# EAGLE design displayBoard (EAGLE 7.4.0)
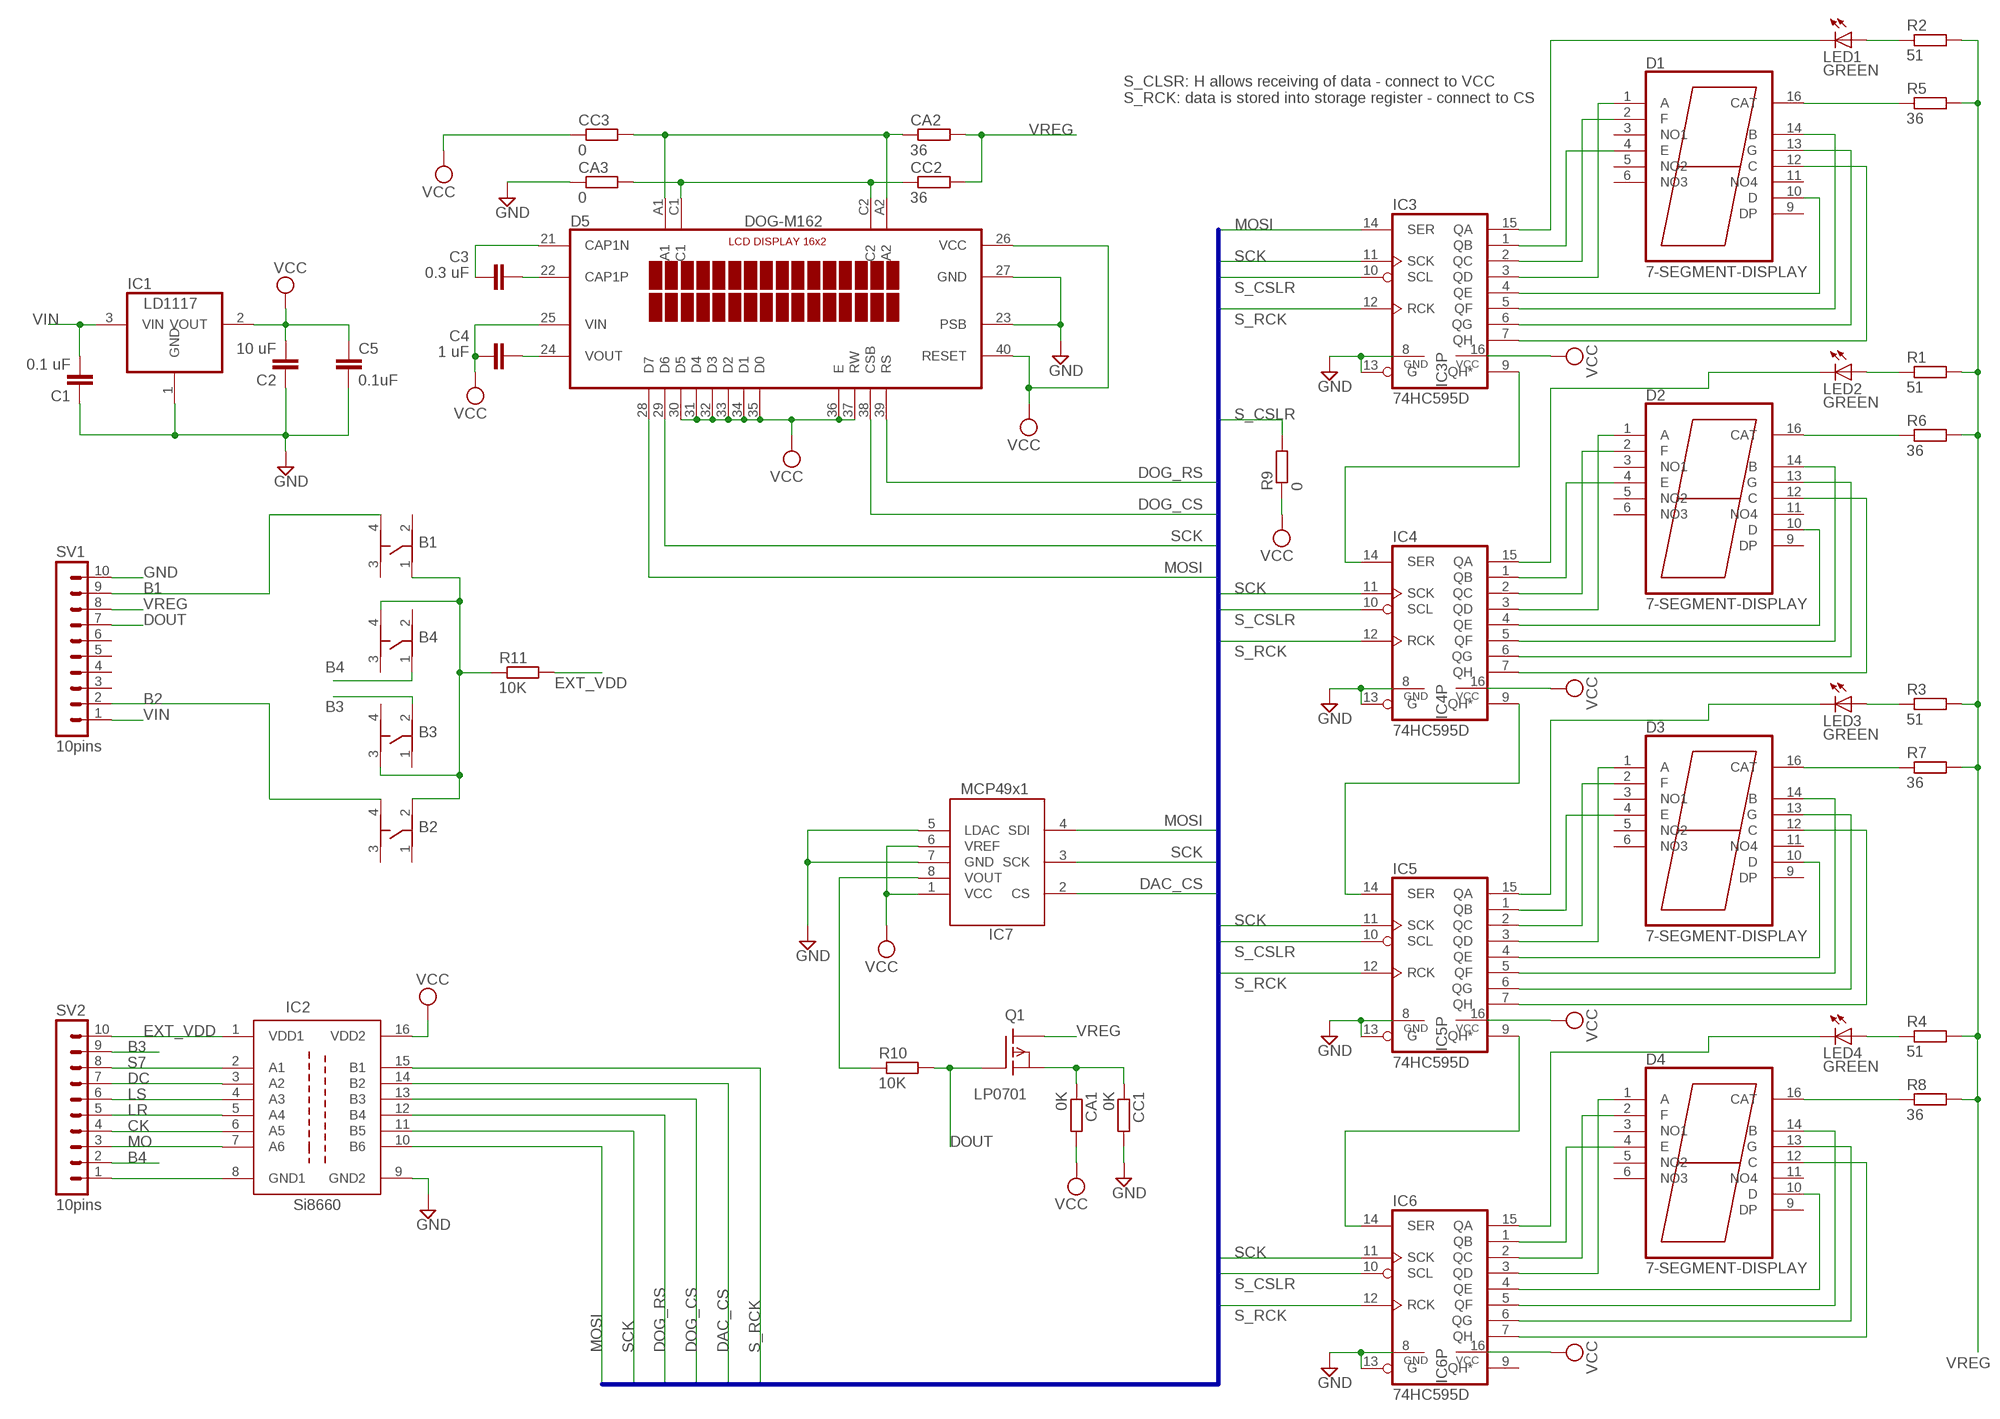
[diagram p0: schematic, sheet 1]

## Parts
B1  BUTTON-D6X  [BUTTON-D6X]
B2  BUTTON-D6X  [BUTTON-D6X]
B3  BUTTON-D6X  [BUTTON-D6X]
B4  BUTTON-D6X  [BUTTON-D6X]
C1  0.1 uF  C-EUC1206  [C1206]
C2  10 uF  C-EUC1206  [C1206]
C3  0.3 uF  C-EUC1206  [C1206]
C4  1 uF  C-EUC1206  [C1206]
C5  0.1uF  C-EUC1206  [C1206]
CA1  0K  R-EU_R1206  [R1206]
CA2  36  R-EU_R1206  [R1206]
CA3  0  R-EU_R1206  [R1206]
CC1  0K  R-EU_R1206  [R1206]
CC2  36  R-EU_R1206  [R1206]
CC3  0  R-EU_R1206  [R1206]
D1  7-SEGMENT-DISPLAY  [LDS-A812]
D2  7-SEGMENT-DISPLAY  [LDS-A812]
D3  7-SEGMENT-DISPLAY  [LDS-A812]
D4  7-SEGMENT-DISPLAY  [LDS-A812]
D5  DOG-M162  [DOGM162]
IC1  LD1117  REG1117  [SOT223]
IC2  SI-8660  [SOP-16]
IC3  74HC595D  [SO16]
IC4  74HC595D  [SO16]
IC5  74HC595D  [SO16]
IC6  74HC595D  [SO16]
IC7  MCP4921  MCP4901  [MSOP-8]
LED1  GREEN  LED3MM  [LED3MM]
LED2  GREEN  LED3MM  [LED3MM]
LED3  GREEN  LED3MM  [LED3MM]
LED4  GREEN  LED3MM  [LED3MM]
Q1  LP0701  LP0701N3  [TO-92]
R1  51  R-EU_R1206  [R1206]
R2  51  R-EU_R1206  [R1206]
R3  51  R-EU_R1206  [R1206]
R4  51  R-EU_R1206  [R1206]
R5  36  R-EU_R1206  [R1206]
R6  36  R-EU_R1206  [R1206]
R7  36  R-EU_R1206  [R1206]
R8  36  R-EU_R1206  [R1206]
R9  0  R-EU_R1206  [R1206]
R10  10K  R-EU_R1206  [R1206]
R11  10K  R-EU_R1206  [R1206]
SV1  10pins  MA10-1  [MA10-1]
SV2  10pins  MA10-1  [MA10-1]

## Nets
B1: B1.4 SV1.9
B2: B2.4 SV1.2
B3: B3.2 SV2.9
B4: B4.1 SV2.2
CK: IC2.6(A5) SV2.4
DAC_CS: IC2.14(B2) IC7.2(CS)
DC: IC2.3(A2) SV2.7
DOG_CS: D5.38(CSB) IC2.13(B3)
DOG_RS: D5.39(RS) IC2.12(B4)
DOUT: Q1.2(G) R10.2 SV1.7
EXT_VDD: IC2.1(VDD1) R11.2 SV2.10
GND: C1.1 C2.1 C5.2 CA3.1 CC1.2 D5.23(PSB) D5.27(GND) IC1.1(GND) IC2.9(GND2) IC3.8(GND) IC3.13(G) IC4.8(GND) IC4.13(G) IC5.8(GND) IC5.13(G) IC6.8(GND) IC6.13(G) IC7.5(LDAC) IC7.7(GND) SV1.10
LR: IC2.5(A4) SV2.5
LS: IC2.4(A3) SV2.6
MO: IC2.7(A6) SV2.3
MOSI: D5.28(D7) IC2.10(B6) IC3.14(SER) IC7.4(SDI)
N$4: D1.12(C) IC3.7(QH)
N$5: D2.4(E) IC4.1(QB)
N$6: D2.1(A) IC4.3(QD)
N$10: D2.10(D) IC4.4(QE)
N$11: D2.13(G) IC4.6(QG)
N$13: D3.4(E) IC5.1(QB)
N$17: D3.2(F) IC5.2(QC)
N$22: D3.1(A) IC5.3(QD)
N$24: D3.13(G) IC5.6(QG)
N$26: D3.12(C) IC5.7(QH)
N$27: D4.4(E) IC6.1(QB)
N$36: IC2.8(GND1) SV2.1
N$37: B1.1 B2.2 B3.3 B4.4 R11.1
N$46: LED4.A R4.1
N$47: LED3.A R3.1
N$48: IC6.15(QA) LED4.K(C)
N$52: IC7.8(VOUT) R10.1
N$63: IC5.15(QA) LED3.K(C)
N$65: IC4.15(QA) LED2.K(C)
N$66: D1.4(E) IC3.1(QB)
N$67: D1.2(F) IC3.2(QC)
N$68: LED2.A R1.1
N$69: D1.1(A) IC3.3(QD)
N$70: D1.10(D) IC3.4(QE)
N$71: D1.14(B) IC3.5(QF)
N$72: D1.13(G) IC3.6(QG)
N$75: D2.2(F) IC4.2(QC)
N$78: D2.14(B) IC4.5(QF)
N$80: D2.12(C) IC4.7(QH)
N$81: IC3.9(QH*) IC4.14(SER)
N$85: D3.10(D) IC5.4(QE)
N$86: D3.14(B) IC5.5(QF)
N$90: D4.2(F) IC6.2(QC)
N$91: D4.1(A) IC6.3(QD)
N$92: D4.10(D) IC6.4(QE)
N$93: D4.14(B) IC6.5(QF)
N$94: D4.13(G) IC6.6(QG)
N$95: D4.12(C) IC6.7(QH)
N$96: IC5.9(QH*) IC6.14(SER)
N$97: IC4.9(QH*) IC5.14(SER)
N$98: D1.16(CAT) R5.1
N$99: D2.16(CAT) R6.1
N$100: D3.16(CAT) R7.1
N$101: D4.16(CAT) R8.1
N$103: IC3.15(QA) LED1.K(C)
N$104: LED1.A R2.1
N$137: CA1.1 CC1.1 Q1.1(S)
N$139: CA2.1 CC3.2 D5.A1 D5.A2
N$141: C3.1 D5.21(CAP1N)
N$142: C3.2 D5.22(CAP1P)
N$143: C4.1 D5.24(VOUT)
N$144: CA3.2 CC2.1 D5.C1 D5.C2
S7: IC2.2(A1) SV2.8
S_CSLR: IC3.10(SCL) IC4.10(SCL) IC5.10(SCL) IC6.10(SCL) R9.2
S_RCK: IC2.15(B1) IC3.12(RCK) IC4.12(RCK) IC5.12(RCK) IC6.12(RCK)
SCK: D5.29(D6) IC2.11(B5) IC3.11(SCK) IC4.11(SCK) IC5.11(SCK) IC6.11(SCK) IC7.3(SCK)
VCC: C2.2 C4.2 C5.1 CA1.2 CC3.1 D5.25(VIN) D5.26(VCC) D5.30(D5) D5.31(D4) D5.32(D3) D5.33(D2) D5.34(D1) D5.35(D0) D5.36(E) D5.37(RW) D5.40(RESET) IC1.2(VOUT) IC2.16(VDD2) IC3.16(VCC) IC4.16(VCC) IC5.16(VCC) IC6.16(VCC) IC7.1(VCC) IC7.6(VREF) R9.1
VIN: C1.2 IC1.3(VIN) SV1.1
VREG: CA2.2 CC2.2 Q1.3(D) R1.2 R2.2 R3.2 R4.2 R5.2 R6.2 R7.2 R8.2 SV1.8
Unconnected: B1.2 B1.3 B2.1 B2.3 B3.1 B3.4 B4.2 B4.3 D1.3(NO1) D1.5(NO2) D1.6(NO3) D1.9(DP) D1.11(NO4) D2.3(NO1) D2.5(NO2) D2.6(NO3) D2.9(DP) D2.11(NO4) D3.3(NO1) D3.5(NO2) D3.6(NO3) D3.9(DP) D3.11(NO4) D4.3(NO1) D4.5(NO2) D4.6(NO3) D4.9(DP) D4.11(NO4) IC6.9(QH*) SV1.3 SV1.4 SV1.5 SV1.6

## Buses
MOSI,SCK,S_CSLR,S_RCK,DOG_RS,DOG_CS,DAC_CS

## Notes on the sheet
- S_CLSR: H allows receiving of data - connect to VCC
  S_RCK: data is stored into storage register - connect to CS

## Library data of the parts
B1-B4 = MyComponents:BUTTON-D6X
C1-C5 = rcl:C-EU: CAPACITOR, European symbol
CA1-CA3 CC1-CC3 R1-R11 = rcl:R-EU_: RESISTOR, European symbol
D1-D4 = MyComponents:7-SEGMENT-DISPLAY: 20.32mm (0.8INCH) SINGLE DIGIT NUMERIC DISPLAY
D5 = MyComponents:DOG-M162: LCD display DOG-SERIE 3,3V. Controlleer ST7036 for 4-/8-BIT, SPI.
IC1 = burr-brown:REG1117: 800mA and 1A Low Dropout (LDO) Positive Regulator 1.8V, 2.5V, 2.85V, 3.3V, 5V, and Adj; MPN: REG1117; OC_FARNELL: 1097566; OC_NEWARK: 14P6981
IC2 = MyComponents:SI-8660: Ultra-low-power digital isolator (6 channels)
IC3-IC6 = 74xx-eu:74*595: 8-bit SHIFT REGISTER, output latch
IC7 = MyComponents:MCP4901: 8/10/12-Bit Voltage Output Digital-to-Analog Converter with SPI Interface
LED1-LED4 = led:LED: LED OSRAM: - CHIPLED LG R971, LG N971, LY N971, LG Q971, LY Q971, LO R971, LY R971 LH N974, LH R974 LS Q976, LO Q976, LY Q976 LO Q996 - Hyper CHIPLED LW Q18S LB Q993, LB Q99A, LB R99A - SideLED LS A670, LO A670, LY A670, LG A670, LP A670 LB A673, LV A673, LT A673, LW A673 LH A674 LY A675 LS A676, LA A676, LO A676, LY A676, LW A676 LS A679, LY A679, LG A679 - Hyper Micro SIDELED® LS Y876, LA Y876, LO Y876, LY Y876 LT Y87S - SmartLED LW L88C, LW L88S LB L89C, LB L89S, LG L890 LS L89K, LO L89K, LY L89K LS L896, LA L896, LO L896, LY L896 - TOPLED LS T670, LO T670, LY T670, LG T670, LP T670 LSG T670, LSP T670, LSY T670, LOP T670, LYG T670 LG T671, LOG T671, LSG T671 LB T673, LV T673, LT T673, LW T673 LH T674 LS T676, LA T676, LO T676, LY T676, LB T676, LH T676, LSB T676, LW T676 LB T67C, LV T67C, LT T67C, LS T67K, LO T67K, LY T67K, LW E67C LS E67B, LA E67B, LO E67B, LY E67B, LB E67C, LV E67C, LT E67C LW T67C LS T679, LY T679, LG T679 LS T770, LO T770, LY T770, LG T770, LP T770 LB T773, LV T773, LT T773, LW T773 LH T774 LS E675, LA E675, LY E675, LS T675 LS T776, LA T776, LO T776, LY T776, LB T776 LHGB T686 LT T68C, LB T68C - Hyper Mini TOPLED® LB M676 - Mini TOPLED Santana® LG M470 LS M47K, LO M47K, LY M47K Source: http://www.osram.convergy.de LUXEON: - LUMILED® LXK2-PW12-R00, LXK2-PW12-S00, LXK2-PW14-U00, LXK2-PW14-V00 LXK2-PM12-R00, LXK2-PM12-S00, LXK2-PM14-U00 LXK2-PE12-Q00, LXK2-PE12-R00, LXK2-PE12-S00, LXK2-PE14-T00, LXK2-PE14-U00 LXK2-PB12-K00, LXK2-PB12-L00, LXK2-PB12-M00, LXK2-PB14-N00, LXK2-PB14-P00, LXK2-PB14-Q00 LXK2-PR12-L00, LXK2-PR12-M00, LXK2-PR14-Q00, LXK2-PR14-R00 LXK2-PD12-Q00, LXK2-PD12-R00, LXK2-PD12-S00 LXK2-PH12-R00, LXK2-PH12-S00 LXK2-PL12-P00, LXK2-PL12-Q00, LXK2-PL12-R00 Source: www.luxeon.com KINGBRIGHT: KA-3528ASYC Source: www.kingbright.com
Q1 = transistor-fet:LP0701N3: P-Channel Enhancement MOSFET -16,5V; -1,25A; 1,5Ohm
SV1 SV2 = con-lstb:MA10-1: PIN HEADER; OC_FARNELL: unknown; OC_NEWARK: unknown

## Board
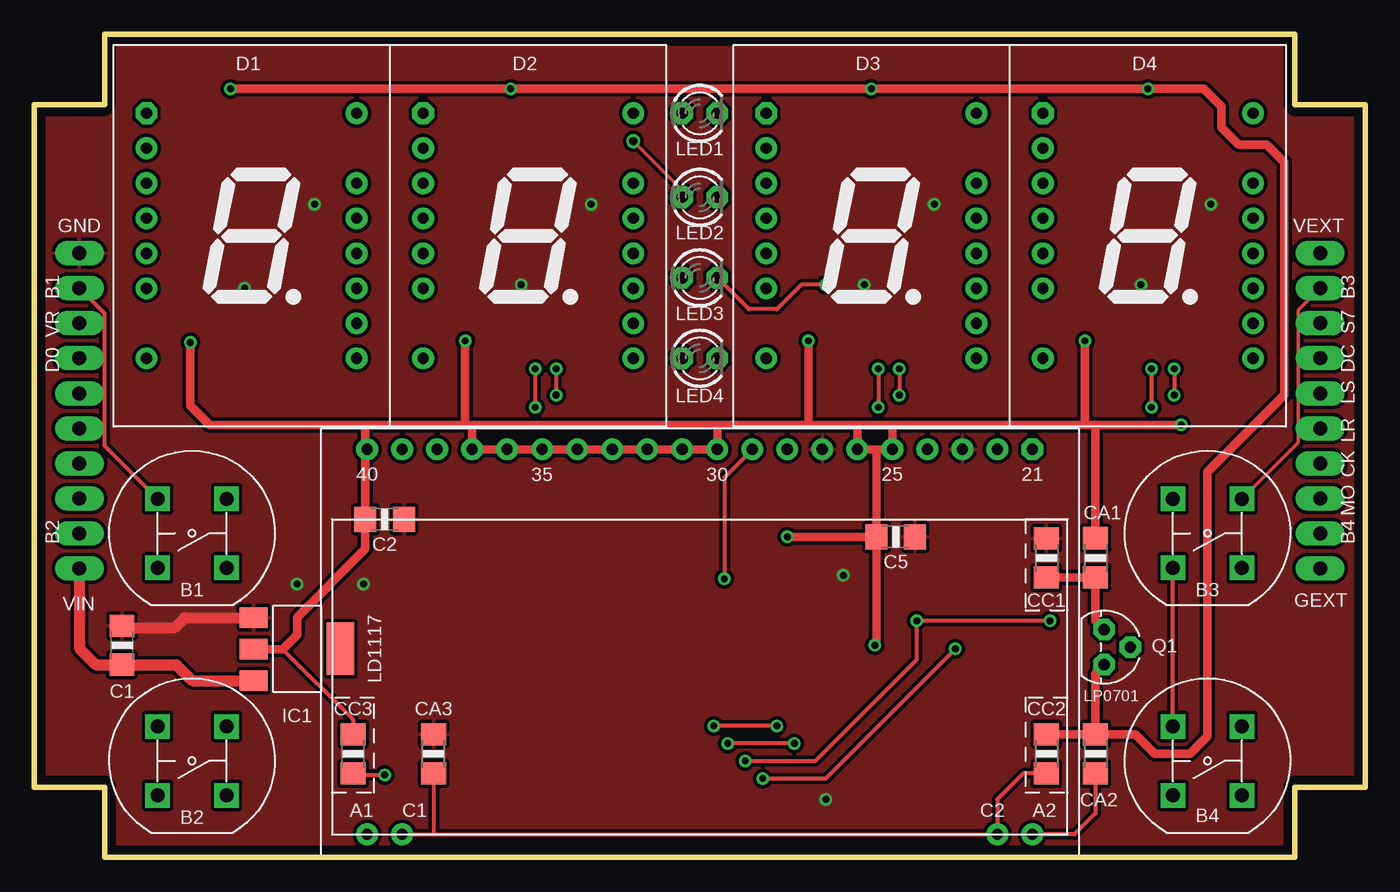
[diagram p1: board, top side]
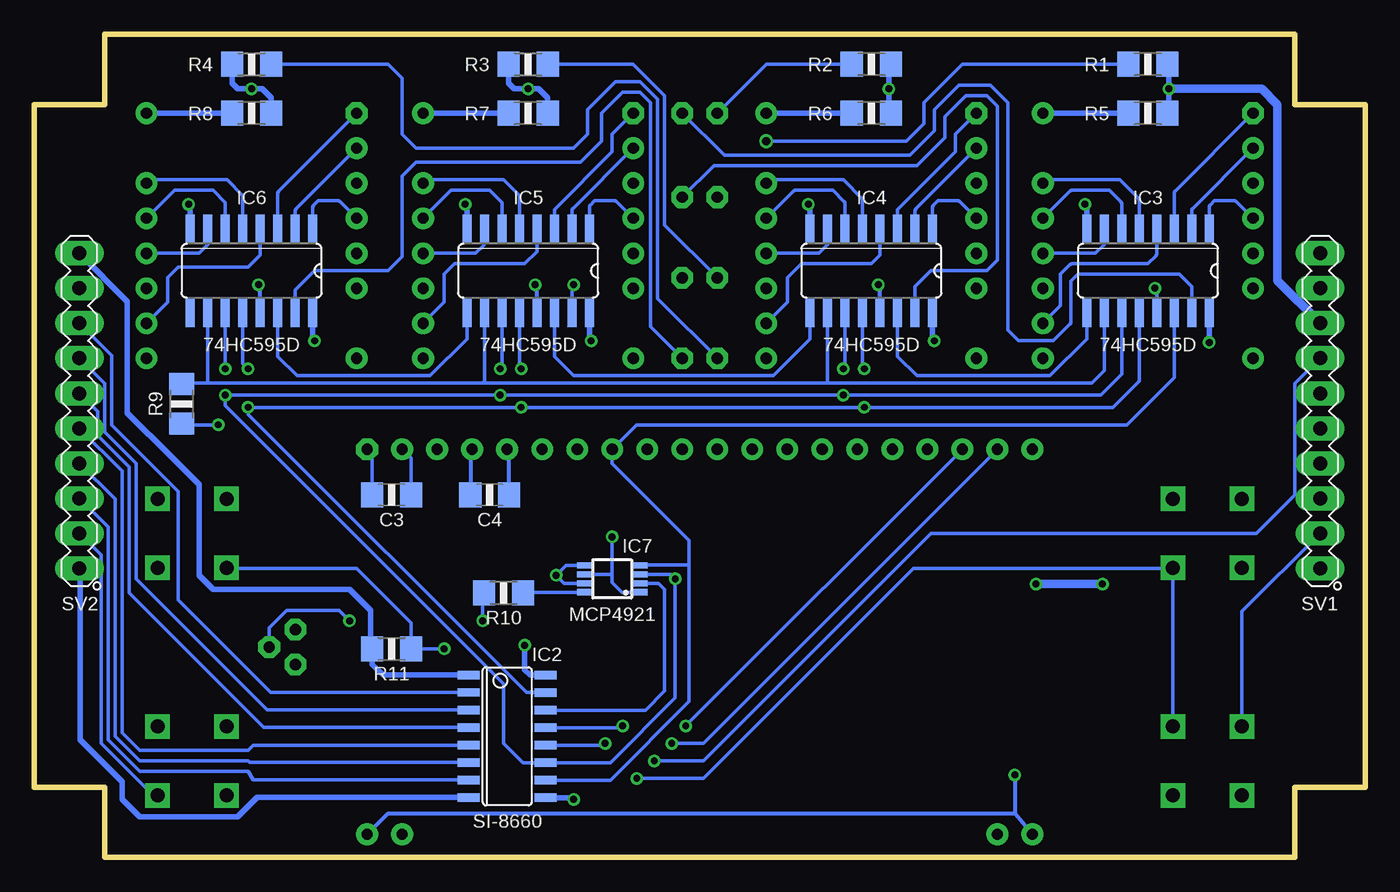
[diagram p2: board, bottom side, seen from below]

Size 96.52 x 59.69 mm. Coordinates in mm from the lower left corner, seen from the top.
Outline: 0,5.08 0,54.61 5.08,54.61 5.08,59.69 91.44,59.69 91.44,54.61 96.52,54.61 96.52,5.08 91.44,5.08 91.44,0 5.08,0 5.08,5.08 0,5.08
Copper layers (1*16): Top 0.035mm / dielectric 1.5mm / Bottom 0.035mm
Design rules "default *": minimum track width 0.000253125mm, minimum drill 0.00048125mm, track to track 10mil, track to pad 12mil, pad to pad 12mil, via to via 12mil, smd to smd 4mil, copper to edge 25mil, drill to drill 40mil, minimum pad ring 15mil, minimum via ring 8mil, stop-mask expansion 4mil, vias tented up to drill 0mil, thermal gap 10mil

### Footprints (pad centres in the part's own frame; a part is rotated, then mirrored left to right if it is on the bottom)
BUTTON-D6X = drill 1.016 square: 1 2.5,-2.5; 2 2.5,2.5; 3 -2.5,-2.5; 4 -2.5,2.5
C1206 = smd 1.6 x 1.8: 1 -1.4,0; 2 1.4,0
R1206 = smd 1.6 x 1.803: 1 -1.422,0; 2 1.422,0
LDS-A812 = drill 0.813 octagon: 1 -7.62,8.89 | drill 0.813: 2 -7.62,6.35; 3 -7.62,3.81; 4 -7.62,1.27; 5 -7.62,-1.27; 6 -7.62,-3.81; 9 7.62,-8.89; 10 7.62,-6.35; 11 7.62,-3.81; 12 7.62,-1.27; 13 7.62,1.27; 14 7.62,3.81; 16 7.62,8.89; P$1 -7.62,-8.89
DOGM162 = drill 0.813 octagon: 21 24.13,13.97 | drill 0.813: 22 21.59,13.97; 23 19.05,13.97; 24 16.51,13.97; 25 13.97,13.97; 26 11.43,13.97; 27 8.89,13.97; 28 6.35,13.97; 29 3.81,13.97; 30 1.27,13.97; 31 -1.27,13.97; 32 -3.81,13.97; 33 -6.35,13.97; 34 -8.89,13.97; 35 -11.43,13.97; 36 -13.97,13.97; 37 -16.51,13.97; 38 -19.05,13.97; 39 -21.59,13.97; 40 -24.13,13.97; A1 -24.13,-13.97; A2 24.13,-13.97; C1 -21.59,-13.97; C2 21.59,-13.97
SOT223 = smd 1.499 x 2.007: 1 -2.261,-3.15; 2 0.025,-3.15; 3 2.311,-3.15 | smd 3.81 x 2.007: 4 0,3.15
SOP-16 = smd 0.6 x 1.6: 1 -4.445,-2.8; 2 -3.185,-2.8; 3 -1.915,-2.8; 4 -0.645,-2.8; 5 0.635,-2.8; 6 1.895,-2.8; 7 3.165,-2.8; 8 4.435,-2.8; 9 4.445,2.8; 10 3.175,2.8; 11 1.905,2.8; 12 0.635,2.8; 13 -0.635,2.8; 14 -1.905,2.8; 15 -3.175,2.8; 16 -4.445,2.8
SO16 = smd 0.66 x 2.032: 1 -4.445,-3.073; 2 -3.175,-3.073; 3 -1.905,-3.073; 4 -0.635,-3.073; 5 0.635,-3.073; 6 1.905,-3.073; 7 3.175,-3.073; 8 4.445,-3.073; 9 4.445,3.073; 10 3.175,3.073; 11 1.905,3.073; 12 0.635,3.073; 13 -0.635,3.073; 14 -1.905,3.073; 15 -3.175,3.073; 16 -4.445,3.073
MSOP-8 = smd 0.45 x 1: 1 -0.975,-2.05; 2 -0.325,-2.05; 3 0.325,-2.05; 4 0.975,-2.05; 5 0.975,2.05; 6 0.325,2.05; 7 -0.325,2.05; 8 -0.975,2.05
LED3MM = drill 0.813 octagon: A -1.27,0; K 1.27,0
TO-92 = drill 0.813 octagon: 1 -1.27,0; 2 0,1.905; 3 1.27,0
MA10-1 = drill 1.016 long: 1 -11.43,0; 2 -8.89,0; 3 -6.35,0; 4 -3.81,0; 5 -1.27,0; 6 1.27,0; 7 3.81,0; 8 6.35,0; 9 8.89,0; 10 11.43,0

### Placement (x,y rotation side)
B1  11.43,23.49 0 top
B2  11.43,6.99 0 top
B3  85.09,23.49 0 top
B4  85.09,6.99 0 top
C1  6.35,15.37 270 top
C2  25.4,24.51 180 top
C3  70.61,26.29 0 bottom
C4  63.5,26.29 0 bottom
C5  62.48,23.24 0 top
CA1  76.97,21.72 90 top
CA2  76.96,7.49 90 top
CA3  28.96,7.49 270 top
CC1  73.41,21.71 90 top
CC2  73.41,7.49 90 top
CC3  23.11,7.49 270 top
D1  15.75,45.09 0 top
D2  35.81,45.09 0 top
D3  60.71,45.09 0 top
D4  80.77,45.09 0 top
D5  48.26,15.62 0 top
IC1  19.05,15.11 270 top
IC2  62.23,8.76 270 bottom
IC3  15.75,42.55 180 bottom
IC4  35.81,42.55 180 bottom
IC5  60.71,42.55 180 bottom
IC6  80.77,42.55 180 bottom
IC7  54.61,20.19 90 bottom
LED1  48.26,53.98 0 top
LED2  48.26,47.88 0 top
LED3  48.26,42.04 0 top
LED4  48.26,36.2 0 top
Q1  77.6,15.24 270 top
R1  15.75,57.53 0 bottom
R2  35.81,57.53 0 bottom
R3  60.71,57.53 180 bottom
R4  80.77,57.53 180 bottom
R5  15.75,53.98 0 bottom
R6  35.81,53.98 0 bottom
R7  60.71,53.98 0 bottom
R8  80.77,53.98 0 bottom
R9  85.85,32.89 90 bottom
R10  62.48,19.18 180 bottom
R11  70.61,15.11 180 bottom
SV1  3.26,32.39 90 bottom
SV2  93.26,32.39 90 bottom

### Tracks (layer width: path | path; a pad name or v marks a point on that pad's centre or on a via)
B1
  Top 0.305: B1.4 5.08,29.84 5.08,39.46 SV1.9
B2
  Bottom 0.254: SV1.2 8.93,17.82 B2.4
B3
  Top 0.254: B3.2 91.69,30.1 91.69,39.71 SV2.9
B4
  Bottom 0.254: B4.1 87.92,4.49 91.69,8.26 91.69,21.93 SV2.2
CK
  Bottom 0.254: IC2.6 80.91,6.87 81.03,6.99 88.9,6.99 90.68,8.76 90.68,25.99 SV2.4
DAC_CS
  Bottom 0.254: IC7.2 51.24,19.87 50.8,19.43 50.8,12.06 52.2,10.67 IC2.14
DC
  Bottom 0.254: IC2.3 79.64,10.68 89.15,20.19 89.15,28.57 91.44,30.86 91.44,34.38 SV2.7
DOG_CS  (via drill 0.5 pad 0.25)
  Top 0.305: v53.85,9.53 v49.28,9.53
  Bottom 0.254: 59.3,9.27 IC2.13 53.98,9.4 v53.85,9.53 | v49.28,9.53 D5.38
DOG_RS  (via drill 0.5 pad 0.25)
  Top 0.305: v55.12,8.26 v50.29,8.26
  Bottom 0.254: 59.3,8 IC2.12 55.24,8.13 v55.12,8.26 | D5.39 48.01,8.26 v50.29,8.26
DOUT  (via drill 0.5, 0.5 pad 0.25)
  Top 0.305: v51.56,6.99 56.64,6.99 64.01,14.35 v64.01,17.14 v73.66,17.14
  Bottom 0.254: SV1.7 5.08,34.38 5.08,26.29 7.87,23.49 31.5,23.49 48.01,6.99 v51.56,6.99 | R10.2 64.01,19.07 v64.01,17.14 | Q1.2 79.5,16.64 78.23,17.91 74.42,17.91 v73.66,17.14
EXT_VDD
  Bottom 0.406: SV2.10 89.78,40.31 89.78,32.23 86.61,29.08 84.58,27.05 84.58,20.45 83.57,19.43 73.66,19.43 72.14,17.91 72.14,15.21 R11.2 72.03,14 71.25,13.21 IC2.1
GND  (via drill 0.5, 0.5 pad 0.25)
  Top 0.813: C1.1 6.48,16.64 10.16,16.64 10.9,17.37 IC1.1
  Bottom 0.254: IC3.13 15.11,41.15 v15.24,41.27 | 40.26,47.14 arc-45 40.33,47.32 | 85.22,47.14 arc-45 85.29,47.32 | IC7.5 57.95,21.17 v58.67,20.45 58.09,19.87 IC7.7
  Bottom 0.305: IC4.13 35.18,41.15 v35.31,41.53 | IC5.13 60.07,41.4 v60.2,41.53 | IC6.13 80.14,41.4 v80.26,41.53
  Bottom 0.406: IC3.8 20.19,47.14 arc-45 20.27,47.32 v20.32,47.37 | IC4.8 40.26,47.14 | 40.33,47.32 v40.39,47.37 | IC5.8 65.15,47.14 arc-45 65.22,47.32 v65.28,47.37 | IC6.8 85.22,47.14 | 85.29,47.32 v85.34,47.37 | IC2.9 57.53,4.32 v57.4,4.19
  Bottom 0.61: v19.05,19.81 v23.87,19.82
  pour Top: 0,54.61 5.08,54.61 5.08,59.69 91.44,59.69 91.44,54.61 96.52,54.61 96.52,5.08 91.44,5.08 91.44,0 5.08,0 5.08,5.08 0,5.08
LR
  Bottom 0.254: IC2.5 80.64,8.13 81.03,7.75 88.9,7.75 90.17,9.02 90.17,28.02 SV2.5
LS
  Bottom 0.254: SV2.6 91.95,32.34 91.95,30.61 89.66,28.32 89.66,19.18 79.89,9.41 IC2.4
MO
  Bottom 0.254: IC2.7 80.66,5.6 81.03,6.22 88.9,6.22 91.19,8.51 91.19,23.96 SV2.3
MOSI
  Bottom 0.254: IC3.14 13.84,34.8 17.27,31.37 52.83,31.37 D5.28 54.61,28.57 49.02,22.99 49.02,21.21 | 49.02,21.21 49.02,11.3 54.74,5.59 IC2.10 | IC7.4 52.52,21.21 49.02,21.21
N$4
  Bottom 0.254: IC3.7 18.92,44.45 19.56,43.82 D1.12
N$5
  Bottom 0.254: IC4.1 31.37,47.14 arc45 31.3,47.32 30.99,47.62 29.57,47.62 arc45 29.39,47.55 D2.4
N$6
  Bottom 0.254: D2.1 29.72,52.45 29.72,51.18 33.91,46.99 IC4.3
N$10
  Bottom 0.254: IC4.4 35.18,43.69 35.81,43.05 40.89,43.05 41.91,42.04 41.91,40.26 D2.10
N$11
  Bottom 0.254: IC4.6 37.72,47.39 arc-45 37.79,47.57 38.61,48.39 41.3,48.39 arc-45 41.48,48.31 D2.13
N$13
  Bottom 0.254: IC5.1 56.26,47.14 arc45 56.19,47.32 55.88,47.62 54.46,47.62 arc45 54.28,47.55 D3.4
N$17
  Bottom 0.254: IC5.2 57.53,46.89 arc45 57.46,47.06 D3.2
N$22
  Bottom 0.254: D3.1 54.61,52.45 54.61,51.18 58.8,46.99 IC5.3
N$24
  Bottom 0.254: IC5.6 62.61,47.5 63.5,48.39 66.29,48.39 D3.13
N$26
  Bottom 0.254: IC5.7 63.88,44.55 arc45 63.95,44.38 64.52,43.82 D3.12
N$27
  Bottom 0.254: IC6.1 76.33,47.14 arc45 76.25,47.32 75.95,47.62 74.53,47.62 arc45 74.35,47.55 D4.4
N$36
  Bottom 0.254: 93.22,20.91 SV2.1
  Bottom 0.406: 93.22,20.91 93.22,8.51 90.17,5.46 90.17,4.19 88.9,2.92 81.79,2.92 80.38,4.33 IC2.8
N$37  (via drill 0.5 pad 0.25)
  Top 0.305: v52.83,5.71 57.4,5.71 v66.8,15.11 | B4.4 B3.3
  Bottom 0.254: v66.8,15.11 R11.1 69.19,16.99 73.15,20.95 82.55,20.95 B3.3 | B2.2 B1.1 13.97,20.95 32.77,20.95 48.01,5.71 v52.83,5.71
N$44  (via drill 0.5 pad 0.25)
  other vias: 53.85,9.53
N$46
  Bottom 0.254: R4.1 70.87,57.53 69.85,56.52 69.85,52.45 68.83,51.44 57.4,51.44 56.39,52.45 56.39,54.23 54.36,56.26 52.58,56.26 51.31,54.99 51.31,40.51 51.05,40.26 LED4.A
N$47
  Bottom 0.254: R3.1 53.09,57.53 50.8,55.25 50.8,45.85 LED3.A
N$48
  Bottom 0.254: 77.6,39.62 IC6.15 77.6,41.15 76.2,42.55 70.87,42.55 69.85,43.56 69.85,49.4 68.83,50.42 56.9,50.42 55.37,51.94 55.37,53.98 53.85,55.5 52.58,55.5 51.82,54.74 51.82,38.48 LED4.K
N$52
  Bottom 0.254: R10.1 61.78,19.22 IC7.8
N$63  (via drill 0.5)
  Top 0.305: v57.4,41.53 55.63,41.53 53.85,39.75 51.82,39.75 LED3.K
  Bottom 0.254: IC5.15 57.53,41.4 v57.4,41.53
N$65
  Bottom 0.254: IC4.15 32.64,41.4 31.5,42.55 27.43,42.55 26.67,43.31 26.67,54.48 27.43,55.25 28.96,55.25 30.48,53.72 30.48,52.2 32.51,50.16 47.24,50.16 LED2.K
N$66
  Bottom 0.254: IC3.1 11.3,47.14 arc45 11.23,47.32 10.92,47.62 9.5,47.62 arc45 9.32,47.55 D1.4
N$67
  Bottom 0.254: IC3.2 12.57,46.89 arc45 12.5,47.06 D1.2
N$68  (via drill 0.6)
  Top 0.254: v43.43,51.94 46.99,48.39 LED2.A
  Bottom 0.254: R1.1 29.21,57.53 32,54.74 32,53.21 33.27,51.94 v43.43,51.94
N$69
  Bottom 0.254: IC3.3 13.84,48.16 arc45 13.77,48.33 D1.1
N$70
  Bottom 0.254: IC3.4 15.11,43.79 arc45 15.19,43.61 15.75,43.05 21.23,43.05 arc-45 21.41,42.98 22.1,42.29 22.1,40.11 arc45 22.17,39.93 D1.10
N$71
  Bottom 0.254: IC3.5 16.38,47.65 arc-45 16.46,47.83 17.78,49.15 23.01,49.15 arc-45 23.19,49.08 D1.14
N$72
  Bottom 0.254: IC3.6 17.65,47.39 arc-45 17.73,47.57 18.54,48.39 21.23,48.39 arc-45 21.41,48.31 D1.13
N$75
  Bottom 0.254: IC4.2 32.64,46.89 arc45 32.56,47.06 D2.2
N$78
  Bottom 0.254: IC4.5 36.45,47.75 37.85,49.15 43.08,49.15 arc-45 43.25,49.08 D2.14
N$80
  Bottom 0.254: IC4.7 38.99,44.45 39.62,43.82 D2.12
N$81
  Bottom 0.254: IC3.9 20.19,37.59 22.86,34.93 32.51,34.93 33.91,36.32 IC4.14
N$85
  Bottom 0.254: IC5.4 60.07,43.94 60.96,43.05 66.04,43.05 66.8,42.29 66.8,40.26 D3.10
N$86
  Bottom 0.254: IC5.5 61.34,48.01 62.48,49.15 68.07,49.15 D3.14
N$90
  Bottom 0.254: IC6.2 77.6,46.89 arc45 77.52,47.06 D4.2
N$91
  Bottom 0.254: IC6.3 78.87,48.16 arc45 78.79,48.33 D4.1
N$92
  Bottom 0.254: IC6.4 80.14,43.69 81.03,42.8 86.11,42.8 86.87,42.04 86.87,40.26 D4.10
N$93
  Bottom 0.254: IC6.5 81.41,48.01 82.55,49.15 88.14,49.15 D4.14
N$94
  Bottom 0.254: IC6.6 82.68,47.5 83.57,48.39 86.36,48.39 D4.13
N$95
  Bottom 0.254: IC6.7 83.95,44.45 84.58,43.82 D4.12
N$96
  Bottom 0.254: IC5.9 65.15,37.59 67.82,34.93 77.47,34.93 78.87,36.32 IC6.14
N$97
  Bottom 0.254: IC4.9 40.26,37.59 42.93,34.93 57.4,34.93 58.8,36.32 IC5.14
N$98
  Bottom 0.406: D1.16 R5.1
N$99
  Bottom 0.406: D2.16 R6.1
N$100
  Bottom 0.406: R7.1 D3.16
N$101
  Bottom 0.406: R8.1 D4.16
N$103
  Bottom 0.254: IC3.15 12.57,41.4 13.46,42.29 20.72,42.29 arc-45 20.9,42.22 21.34,41.78 21.34,38.84 arc45 21.41,38.66 22.61,37.47 25.15,37.47 25.91,38.23 25.91,54.74 27.18,56.01 29.46,56.01 31.24,54.23 31.24,52.71 33.02,50.93 46.48,50.93 LED1.K
N$104
  Bottom 0.254: 37.24,57.79 R2.1 43.43,57.53 LED1.A
N$105  (via drill 0.5 pad 0.25)
  other vias: 49.28,9.53
N$106  (via drill 0.5 pad 0.25)
  other vias: 55.12,8.26
N$107  (via drill 0.5 pad 0.25)
  other vias: 50.29,8.26
N$108  (via drill 0.5 pad 0.25)
  other vias: 52.83,5.71
N$109  (via drill 0.5 pad 0.25)
  other vias: 66.8,15.11
N$111  (via drill 0.5)
  other vias: 57.4,41.53
N$137
  Top 0.61: Q1.1 76.97,17.14 CA1.1 76.2,20.29 CC1.1
N$139  (via drill 0.5)
  Top 0.305: CA2.1 76.96,3.17 75.44,1.65 D5.A2 | CC3.2 23.22,5.97 v25.4,5.97
  Bottom 0.305: D5.A2 70.87,3.17 25.4,3.17 | 25.4,3.17 D5.A1 | v25.4,5.97 25.4,3.17
N$141
  Bottom 0.254: D5.21 72.01,29.21 C3.1
N$142
  Bottom 0.254: D5.22 69.21,28.95 C3.2
N$143
  Bottom 0.305: D5.24 64.9,29.46 C4.1
N$144
  Top 0.305: CC2.1 71.73,6.07 69.85,4.19 D5.C2 29.21,1.65 28.96,1.65 | D5.C1 28.96,1.65 | CA3.2 28.96,1.65
N$161  (via drill 0.5)
  other vias: 25.4,5.97
N$162  (via drill 0.6)
  other vias: 43.43,51.94
S7
  Bottom 0.254: SV2.8 90.93,36.41 90.93,31.37 86.11,26.54 86.11,18.67 79.39,11.95 IC2.2
S_CSLR
  Bottom 0.254: IC3.10 18.92,35.31 19.81,34.42 39.12,34.42 | 39.12,34.42 64.01,34.42 | 64.01,34.42 83.95,34.42 | IC4.10 38.99,34.54 39.12,34.42 | IC5.10 63.88,34.54 64.01,34.42 | 83.95,34.42 IC6.10 | R9.2 85.75,34.42 83.95,34.42
S_RCK  (via drill 0.5 pad 0.25)
  Top 0.305: v81.03,35.43 v81.03,32.64 | v61.21,35.43 v61.21,32.64 | v36.32,35.43 v36.32,32.64
  Bottom 0.254: IC3.12 16.38,34.54 18.29,32.64 v36.32,32.64 v61.21,32.64 v81.03,32.64 81.03,32.13 60.83,11.94 IC2.15 | IC4.12 36.45,35.56 v36.32,35.43 | IC5.12 61.34,35.56 v61.21,35.43 | IC6.12 81.41,35.81 v81.03,35.43
SCK  (via drill 0.5 pad 0.25)
  Top 0.305: v82.68,35.43 v82.68,33.53 | v62.74,35.43 v62.74,33.53 | v37.85,35.43 v37.85,33.53 | D5.29 50.04,27.56 v50.04,20.19
  Bottom 0.254: IC3.11 17.65,35.05 19.18,33.53 v37.85,33.53 v62.74,33.53 v82.68,33.53 82.68,32.77 62.48,12.57 62.48,8.26 61.09,6.86 IC2.11 54.74,6.86 50.04,11.56 v50.04,20.19 50.36,20.52 IC7.3 | IC4.11 37.72,35.56 v37.85,35.43 | IC5.11 62.61,35.56 v62.74,35.43 | IC6.11 v82.68,35.43
VCC  (via drill 0.5 pad 0.25)
  Top 0.305: 18.01,15.09 23.11,9.98 CC3.1
  Top 0.406: 61.08,29.46 61.21,29.59 | 61.08,15.24 v60.96,15.37
  Top 0.61: IC1.2 18.01,15.09 19.05,16.13 19.05,17.4 24,22.35 C2.2 24,29.46 arc-90 D5.40 arc-90 23.98,29.75 23.98,31.37 | 76.2,31.37 v76.2,37.47 | v11.3,37.34 11.3,32.77 12.7,31.37 23.98,31.37 | 23.98,31.37 31.24,31.37 | 31.24,31.37 31.75,31.37 | 31.75,31.37 49.53,31.37 | 49.53,31.37 56.13,31.37 | 56.13,31.37 59.69,31.37 | 59.69,31.37 62.23,31.37 | 62.23,31.37 75.69,31.37 | 75.69,31.37 76.2,31.37 | v31.24,37.47 31.24,31.37 | v56.13,37.47 56.13,31.37 | 31.75,31.37 D5.37 D5.36 D5.35 D5.34 D5.33 D5.32 D5.31 D5.30 49.53,31.37 | 59.69,31.37 D5.26 61.21,29.59 D5.25 62.23,31.37 | 61.08,17.91 C5.1 | C5.1 61.09,15.5 v60.96,15.37 | 76.2,31.37 76.45,31.37 | 76.45,31.37 v83.19,31.37 | C5.1 v54.61,23.24 | C5.1 61.08,29.46 | 75.7,31.36 75.69,31.37 | CA1.2 76.97,31.37 76.45,31.37
  Top 0.813: D5.30 49.78,29.59
  Bottom 0.254: v54.61,23.24 54.61,20.45 | 54.61,20.45 54.61,19.94 53.89,19.22 IC7.1 | IC7.6 54.68,20.52 arc90 54.61,20.45 | v83.19,31.37 85.75,31.37 R9.1
  Bottom 0.305: C4.2 62.1,29.59 D5.25
  Bottom 0.406: IC3.16 v11.3,37.34 | IC4.16 31.37,37.59 v31.24,37.47 | IC5.16 56.26,37.59 v56.13,37.47 | IC6.16 76.33,37.59 v76.2,37.47 | IC2.16 60.58,13.21 60.96,13.59 v60.96,15.37
VIN
  Top 0.813: SV1.1 3.26,15.15 4.45,13.97 C1.2 10.29,13.97 11.46,12.8 IC1.3
VREG  (via drill 0.5 pad 0.25)
  Top 0.61: v14.22,55.75 v34.54,55.75 v60.71,55.75 v80.77,55.75 84.84,55.75 86.11,54.48 86.11,52.96 87.38,51.69 89.41,51.69 90.68,50.42 90.68,33.53 85.09,27.94 85.09,8.76 83.82,7.49 81.28,7.49 79.86,8.92 CA2.2 | Q1.3 76.96,13.34 CA2.2 | CA2.2 CC2.2
  Bottom 0.254: R8.2 79.25,54.08
  Bottom 0.406: R7.2 59.28,55.09 59.94,55.75 v60.71,55.75 61.72,55.75 62.13,56.16 R3.2 | SV1.8 3.26,38.78 | 82.3,57.43 R4.2 82.19,56.16 81.79,55.75 v80.77,55.75 80.01,55.75 79.35,55.09 R8.2 | R2.2 34.54,57.38 v34.54,55.75 34.54,54.13 R6.2 | R5.2 14.22,54.08 v14.22,55.75 14.22,57.43 R1.2
  Bottom 0.61: v14.22,55.75 7.49,55.75 6.35,54.61 6.35,41.83 SV1.8

### Text on the board
tNames: GND | VEXT | B1 | B3 | S7 | VR | D0 | DC | LS | LR | CK | MO | B2 | B4 | VIN | GEXT